# EAGLE design ScoutMakes_Azul (EAGLE 9.6.1)
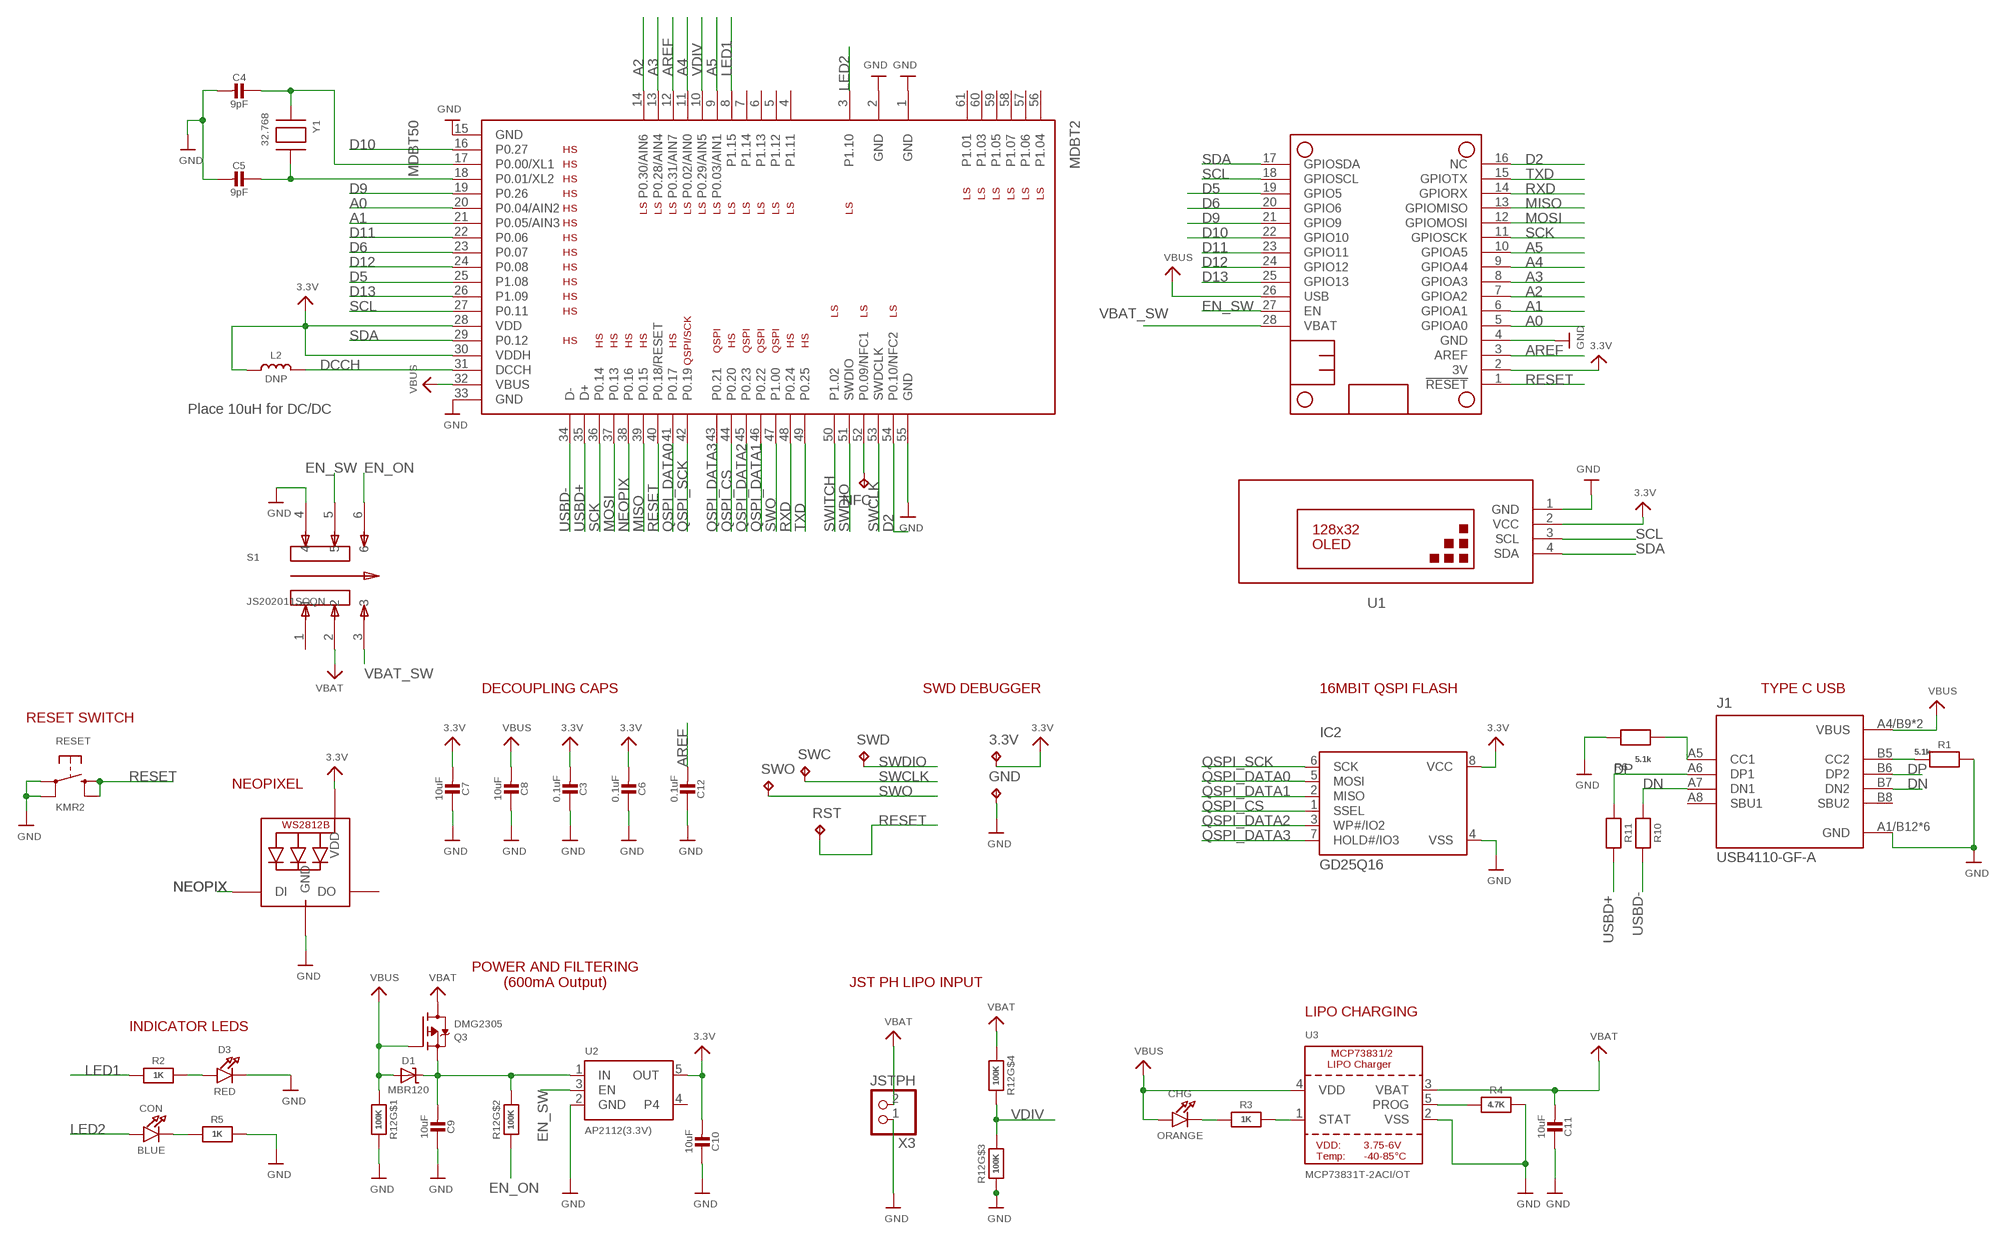
[diagram p0: schematic, sheet 1]

## Parts
3.3V  TPTP12R  [TP12R]
C3  0.1uF  CAP_CERAMIC0603_NO  [0603-NO]
C4  9pF  CAP_CERAMIC0603_NO  [0603-NO]
C5  9pF  CAP_CERAMIC0603_NO  [0603-NO]
C6  0.1uF  CAP_CERAMIC0603_NO  [0603-NO]
C7  10uF  CAP_CERAMIC0805-NOOUTLINE  [0805-NO]
C8  10uF  CAP_CERAMIC0805-NOOUTLINE  [0805-NO]
C9  10uF  CAP_CERAMIC0805-NOOUTLINE  [0805-NO]
C10  10uF  CAP_CERAMIC0805-NOOUTLINE  [0805-NO]
C11  10uF  CAP_CERAMIC0805-NOOUTLINE  [0805-NO]
C12  0.1uF  CAP_CERAMIC0603_NO  [0603-NO]
CHG  ORANGE  LED0805_NOOUTLINE  [CHIPLED_0805_NOOUTLINE]
CON  BLUE  LED0805_NOOUTLINE  [CHIPLED_0805_NOOUTLINE]
D1  MBR120  DIODE-SCHOTTKYSOD-123  [SOD-123]
D3  RED  LED0805_NOOUTLINE  [CHIPLED_0805_NOOUTLINE]
GND  TPTP12R  [TP12R]
IC2  GD25Q16  SPIFLASH_8PINUX  [USON8]
J1  USB4110-GF-A  [GCT_USB4110-GF-A]
L2  DNP  INDUCTOR_0805MP  [_0805MP]
LED  WS2812B3535  [LED3535]
MDBT2  MDBT50  [MDBT50]
MS1  FEATHERWING_NODIM  [FEATHERWING_NODIM]
NFC  TPTP10R  [TP10R]
Q3  DMG2305  MOSFET-P  [SOT23-R]
R1  5.1k  RESISTOR_0603_NOOUT  [0603-NO]
R2  1K  RESISTOR_0603_NOOUT  [0603-NO]
R3  1K  RESISTOR_0603_NOOUT  [0603-NO]
R4  4.7K  RESISTOR_0603_NOOUT  [0603-NO]
R5  1K  RESISTOR_0603_NOOUT  [0603-NO]
R6  5.1k  RESISTOR_0603_NOOUT  [0603-NO]
R10  22  RESISTOR_0603_NOOUT  [0603-NO]
R11  22  RESISTOR_0603_NOOUT  [0603-NO]
R12  100K  RESISTOR_4PACK  [RESPACK_4X0603]
RESET  KMR2  SWITCH_TACT_SMT4.6X2.8  [BTN_KMR2_4.6X2.8]
RST  TPTP12R  [TP12R]
S1  JS202011SCQN  [SW_JS202011SCQN]
SWC  TPTP12R  [TP12R]
SWD  TPTP12R  [TP12R]
SWO  TPTP12R  [TP12R]
U1  DISPLAY-OLED-128X32  [DISPLAY-OLED-128X32]
U2  AP2112(3.3V)  VREG_SOT23-5  [SOT23-5]
U3  MCP73831T-2ACI/OT  MCP73831/2  [SOT23-5]
X3  JSTPH  CON_JST_PH_2PIN  [JSTPH2]
Y1  32.768  XTAL-3.2X1.5  [XTAL3215]

## Nets
3.3V [power]: 3.3V.TP C3.2 C6.2 C7.2 C10.2 IC2.8(VCC) L2.1 LED.2(VDD) MDBT2.28(VDD) MDBT2.30(VDDH) MS1.2(3V) U1.2(VCC) U2.5(OUT)
A0: MDBT2.20(P0.04/AIN2) MS1.5(GPIOA0)
A1: MDBT2.21(P0.05/AIN3) MS1.6(GPIOA1)
A2: MDBT2.14(P0.30/AIN6) MS1.7(GPIOA2)
A3: MDBT2.13(P0.28/AIN4) MS1.8(GPIOA3)
A4: MDBT2.11(P0.02/AIN0) MS1.9(GPIOA4)
A5: MDBT2.9(P0.03/AIN1) MS1.10(GPIOA5)
AREF: C12.2 MDBT2.12(P0.31/AIN7) MS1.3(AREF)
D2: MDBT2.54(P0.10/NFC2) MS1.16(NC)
D5: MDBT2.25(P1.08) MS1.19(GPIO5)
D6: MDBT2.23(P0.07) MS1.20(GPIO6)
D9: MDBT2.19(P0.26) MS1.21(GPIO9)
D10: MDBT2.16(P0.27) MS1.22(GPIO10)
D11: MDBT2.22(P0.06) MS1.23(GPIO11)
D12: MDBT2.24(P0.08) MS1.24(GPIO12)
D13: MDBT2.26(P1.09) MS1.25(GPIO13)
DCCH: L2.2 MDBT2.31(DCCH)
DN: J1.A7(DN1) J1.B7(DN2) R10.1
DP: J1.A6(DP1) J1.B6(DP2) R11.1
EN_ON: R12.2 S1.6
EN_SW: MS1.27(EN) S1.5 U2.3(EN)
GND: C3.1 C4.2 C5.2 C6.1 C7.1 C8.1 C9.1 C10.1 C11.1 C12.1 D3.C GND.TP IC2.4(VSS) J1.A1/B12(GND) J1.B1/A12(GND) J1.S1(GND) J1.S2(GND) J1.S3(GND) J1.S4(GND) LED.4(GND) MDBT2.1(GND) MDBT2.2(GND) MDBT2.15(GND) MDBT2.33(GND) MDBT2.55(GND) MS1.4(GND) R1.2 R4.2 R5.2 R6.2 R12.3 R12.8 RESET.A'(P1) RESET.A(P) S1.4 U1.1(GND) U2.2(GND) U3.2(VSS) X3.1
LED1: MDBT2.8(P1.15) R2.1
LED2: CON.A MDBT2.3(P1.10)
MISO: MDBT2.39(P0.15) MS1.13(GPIOMISO)
MOSI: MDBT2.37(P0.13) MS1.12(GPIOMOSI)
N$1: C4.1 MDBT2.17(P0.00/XL1) Y1.P$1
N$2: C5.1 MDBT2.18(P0.01/XL2) Y1.P$2
N$3: CHG.C R3.1
N$4: J1.A5(CC1) R6.1
N$5: D3.A R2.2
N$6: J1.B5(CC2) R1.1
N$11: R3.2 U3.1(STAT)
N$12: R4.1 U3.5(PROG)
N$14: CON.C R5.1
NEOPIX: LED.1(DI) MDBT2.38(P0.16)
NFC1: MDBT2.52(P0.09/NFC1) NFC.TP
QSPI_CS: IC2.1(SSEL) MDBT2.44(P0.20)
QSPI_DATA0: IC2.5(MOSI) MDBT2.41(P0.17)
QSPI_DATA1: IC2.2(MISO) MDBT2.46(P0.22)
QSPI_DATA2: IC2.3(WP#/IO2) MDBT2.45(P0.23)
QSPI_DATA3: IC2.7(HOLD#/IO3) MDBT2.43(P0.21)
QSPI_SCK: IC2.6(SCK) MDBT2.42(P0.19)
RESET: MDBT2.40(P0.18/RESET) MS1.1(!RESET) RESET.B'(S1) RESET.B(S) RST.TP
RXD: MDBT2.48(P0.24) MS1.14(GPIORX)
SCK: MDBT2.36(P0.14) MS1.11(GPIOSCK)
SCL: MDBT2.27(P0.11) MS1.18(GPIOSCL) U1.3(SCL)
SDA: MDBT2.29(P0.12) MS1.17(GPIOSDA) U1.4(SDA)
SWCLK: MDBT2.53(SWDCLK) SWC.TP
SWDIO: MDBT2.51(SWDIO) SWD.TP
SWITCH: MDBT2.50(P1.02)
SWO: MDBT2.47(P1.00) SWO.TP
TXD: MDBT2.49(P0.25) MS1.15(GPIOTX)
USBD+: MDBT2.35(D+) R11.2
USBD-: MDBT2.34(D-) R10.2
VBAT [power]: C11.2 Q3.3(D) R12.4 S1.2 U3.3(VBAT) X3.2
VBAT_SW [power]: MS1.28(VBAT) S1.3
VBUS [power]: C8.2 CHG.A D1.A J1.A4/B9(VBUS) J1.B4/A9(VBUS) MDBT2.32(VBUS) MS1.26(USB) Q3.1(G) R12.1 U3.4(VDD)
VDIV: MDBT2.10(P0.29/AIN5) R12.5 R12.6
VHI [power]: C9.2 D1.C Q3.2(S) R12.7 U2.1(IN)
Unconnected: J1.A8(SBU1) J1.B8(SBU2) LED.3(DO) MDBT2.4(P1.11) MDBT2.5(P1.12) MDBT2.6(P1.13) MDBT2.7(P1.14) MDBT2.56(P1.04) MDBT2.57(P1.06) MDBT2.58(P1.07) MDBT2.59(P1.05) MDBT2.60(P1.03) MDBT2.61(P1.01) S1.1 U2.4

## Notes on the sheet
- Place 10uH for DC/DC
- DECOUPLING CAPS | SWD DEBUGGER | 16MBIT QSPI FLASH | TYPE C USB
- RESET SWITCH
- NEOPIXEL
- POWER AND FILTERING
  (600mA Output)
- JST PH LIPO INPUT
- LIPO CHARGING
- INDICATOR LEDS

## Library data of the parts
3.3V GND NFC RST SWC SWD SWO = testpad:TP: Test pad
C3-C12 = microbuilder:CAP_CERAMIC: Ceramic Capacitors For new designs, use the packages preceded by an '_' character since they are more reliable: The following footprints should be used on most boards: _0402 - Standard footprint for regular board layouts _0603 - Standard footprint for regular board layouts _0805 - Standard footprint for regular board layouts _1206 - Standard footprint for regular board layouts For extremely tight-pitch boards where space is at a premium, the following 'micro-pitch' footprints can be used (smaller pads, no silkscreen outline, etc.): _0402MP - Micro-pitch footprint for very dense/compact boards _0603MP - Micro-pitch footprint for very dense/compact boards _0805MP - Micro-pitch footprint for very dense/compact boards _1206MP - Micro-pitch footprint for very dense/compact boards
CHG CON D3 = microbuilder:LED: LED 0603 - 0603 Surface Mount Package 2mA: Green LED - Low Power (3.9mcd, 2ma, 1.7Vf) - Digikey: 475-2709-2-ND Orange LED - Low Power (9.8mcd, 2ma, 1.8Vf) - Digikey: 475-1194-2-ND Red LED - Low Power (5mcd, 2ma, 1.8Vf) - Digikey: 475-1195-2-ND Yellow LED - Low Power (7mcd, 2ma, 1.8Vf) - Digikey: 475-1196-2-ND 5mA: Blue LED - Low Power (17mcd, 5ma, 2.9Vf) - Digikey: LNJ937W8CRACT-ND 0805 - 0805 Surface Mount Package 2mA: Red LED (8.8mcd, 2mA, 1.8Vf, Clear) - Low Power [Digikey: 475-2510-1-ND] Green LED (5mcd, 2mA, 1.8Vf, Clear) - Low Power [Digikey: 475-2730-1-ND] Yellow LED (11.3mcd, 2mA, 1.8Vf, Clear) - Low Power [Digikey: 475-2555-1-ND] 20mA: Red LED (104mcd, 20mA, Diffused) - LS R976 [Digikey: 475-1278-6-ND] Red LED (12mcd, 20mA, 2.0Vf, Clear) - APT2012EC [Digikey: 754-1128-1-ND] Green LED (15mcd, 20mA, 2.2Vf, Clear) - APT2012GC [Digikey: 754-1131-1-ND] Orange LED (160mcd, 20mA, 2.1Vf, Clear) - APT2012SECK [Digikey: 754-1130-1-ND] 1206 - 1206 Surface Mount Package Green LED (26mcd, 20mA, Diffused) - LG N971 [Digikey: 475-1407-6-ND] Red LED (15mcd, 20mA, Diffused) - LH N974 [Digikey: 475-1416-6-ND] Cree - Cree High-Power Surface Mount LEDs XPEBWT-L1-0000-00D50 - White 111lm 350mA 2.9Vf 6200K 110° XTEAWT-00-0000-00000LEE3 - White 114lm 350mA 2.85Vf 5000K 115° Everlight - Everlight 45-21 Series Surface Mount LEDs 45-21/QK2C-B2832AC2CB2/2T - Warm White 2000mcd 20mA 3.25Vf 3050K 120° 45-21/LK2C-B38452C4CB2/2T - Nuetral White 2000mcd 20mA 3.25Vf 4150K 120° 45-21/LK2C-B50634C6CB2/2T - Cold White 2200mcd 20mA 3.25Vf 5650K 120° PLCC2 Reverse Mount LS T77K-J1L2-1-0-2-R18-Z - Red 11.25mcd 2mA 1.8Vf 630nm 120° LO T77K-L1M2-24-Z - Orange 19.6mcd 2mA 1.8Vf 606nm 120° LY T77K-K2M1-26-Z - Yellow 15.7mcd 2mA 1.8Vf 587nm 120°
D1 = microbuilder:DIODE-SCHOTTKY
IC2 = microbuilder:SPIFLASH_8PIN: SOIC8 SPI Flash Be careful with the size since SOIC8 flash comes in several 'widths' SOIC8 150 mil M25P16 - 16Mbit (2Mbit x 8) Serial Flash (75MHz SPI Bus), Supply: 2.7-3.6V Digikey: SOIC8 - M25P16-VMN6P-ND SOIC8 208 mil W25Q16BVSSIG - 16Mbit (2Mbit x 8) Serial Flash (104MHz SPI Bus), Supply: 2.7-3.6V Digikey: SOIC8 - W25Q16BVSSIG-ND
J1 = usb_typeC-USB4110-GF-A:USB4110-GF-A: CONN USB 2.0 TYPE-C R/A SMT; AVAILABILITY: Unavailable; DESCRIPTION: USB-C _USB TYPE-C_ USB 2.0 Receptacle Connector 24 _16+8 Dummy_ Position Surface Mount, Right Angle; Through Hole; MF: GCT; MP: USB4110-GF-A; PACKAGE: None; PRICE: None
L2 = microbuilder:INDUCTOR: Inductors 0603: 10nH Ceramic Inductor - microwire antenna/RF (Digikey: 712-1434-2-ND) 0805: 560nH Ceramic Inductor - RF (Digikey: 553-1047-1-ND) 270nH Ceramic Inductor - Q = 40@250MHz, +-5%, 1 Ohm DC Resistance (Digikey: 535-10506-2-ND) 1007 (2518 Metric) SMT: 10µH 10% 250mOhm 820mA 1007 Inductor (Digikey: 587-2189-1-ND) 22µH 10% 500mOhm 580mA 1007 Inductor (Digikey: 587-2190-1-ND) 47µH 10% 950mOhm 420mA 1007 Inductor (Digikey: 587-2191-1-ND) 47µH 5% 100mOhm 1A 1008 Inductor (Digikey: 732-1816-1-ND) 5.0x5.0mm (Taiyo Yuden NR5040 Series) 6.8µH 20% 2.3A 64mOhm Inductor (Digikey: 587-2374-2-ND) 5.0x5.0mm (TDK VLC5045 Series) 4.7µH 20% 3.3A 34mOhm Inductor (Digikey: 445-6526-1-ND) 6.8µH 20% 2.7A 46mOhm Inductor (Digikey: 445-6527-1-ND) 6.0x6.0mm (TDK VLC6045 Series) 4.7µH 20% 3.8A 27mOhm Inductor (Digikey: 445-6538-2-ND) 6.8µH 20% 3A 41mOhm Inductor (Digikey: 445-6540-1-ND) 6.2µH 30% 2.2A 45mOhm Inductor (Digikey: SRR5028-6R2YCT-ND) - Not TDK VLC6045 but footprint should match 6.0x6.0mm (TDK SLF6045 Series) 6.8uH 30% 2A 33mOhm Inductor (Digikey: 445-4572-1-ND, Mouser: 810-SLF645T6R8N2R0PF) 6.0x6.0mm (Sumida CDRH5D28 Series) 6.2uH 30% 1.8A 45mOhm Inductor (Digikey: 308-1542-1-ND) Taiyo Yuden NR3015T2R2M - 2.2uH 20% 1.5A (Digikey: 587-1648-2-ND, Mouser: 963-NR3015T2R2M) - Used with TI TPS62172 CoilCraft RFID Transponder Coil - MA5532-AE (For use with AS3935 Lightning Sensor) Taiyo Yuden NRH2412T2R2MNGH - 2.2uH 20% 1AA (Digikey: 587-3443-1-ND) - Used with TI LM3671 Vishay IHLP 1.0uH Molded Inductor - 24mOhm DCR, 5A, +/-20%, -55°C-125°C (Digikey: 541-1319-1-ND)
LED = microbuilder:WS2812B
MDBT2 = microbuilder:MDBT50: Raytac Corporation MDBT50 Bluetooth Low Energy Module based on Noridc nRF52840 Source: Raytac datasheet
MS1 = microbuilder:FEATHERWING
Q3 = microbuilder:MOSFET-P: P-Channel Mosfet LEGEND VDS: Voltage Drain-Source ID: Drain Current RDS(ON): Drain-Source On-State Resistance VGS(TH): Gate-Source Threshold Voltage CISS: Drain-Source Input Capacitance SOT-23 Name VDS ID RDS(ON) VGS(TH) CISS Order Number IRLML5103 30V 760mA 600 mOhm -- 75pF @ 25V Digikey: IRLML5103PBFCT-ND IRLML6401 12V 4.3A 50 mOhm 950mV @ 250µA 830pF @ 10V Digikey: IRLML6401PBFTR-ND NTR0202PL 20V 400mA 800 mOhm 2.3V @ 250uA 70pF @ 5V Digikey: NTR0202PLT1GOSTR-ND NTR4101PT1G 20V 1.8A 85 mOhm 1.2V @ 250uA 675pF @ 10V Digikey: NTR4101PT1GOSCT-ND DMP2004K 20V 600mA 900 mOhm 1V @ 250uA 175pF @ 16V Digikey: DMP2004KDICT-ND PMV65XP 20V 3.9A 76 mOhm 950mV @ 1mA 725pF @ 20V Digikey: 568-2358-2-ND TO-252 Name VDS ID RDS(ON) VGS(TH) CISS Order Number AOD417 30V 25A 34 mOhm 3V @ 250µA 920pF @ 15V Digikey: 785-1106-2-ND PowerPak Name VDS ID RDS(ON) VGS(TH) CISS Order Number AON7401 30V 12A 14 mOhm 3V @ 250µA 2600pF @ 15V Digikey: 785-1302-1-ND
R1-R6 R10 R11 = microbuilder:RESISTOR: Resistors For new designs, use the packages preceded by an '_' character since they are more reliable: The following footprints should be used on most boards: _0402 - Standard footprint for regular board layouts _0603 - Standard footprint for regular board layouts _0805 - Standard footprint for regular board layouts _1206 - Standard footprint for regular board layouts For extremely tight-pitch boards where space is at a premium, the following 'micro-pitch' footprints can be used (smaller pads, no silkscreen outline, etc.): _0402MP - Micro-pitch footprint for very dense/compact boards _0603MP - Micro-pitch footprint for very dense/compact boards _0805MP - Micro-pitch footprint for very dense/compact boards _1206MP - Micro-pitch footprint for very dense/compact boards
R12 = microbuilder:RESISTOR_4PACK: Resistor Packs (4 resistors) 4 x 0603 10K 1/16W - Digikey: YC164J-10KCT-ND
RESET = microbuilder:SWITCH_TACT_SMT: SMT Tact Switches 6x6mm - Digikey: P12940SCT-ND KMR2 (4.6x2.8mm) - Digikey: 401-1426-1-ND EVQ-PQHB55 - Light Touch, 160GF (4.5x4.5mm) - Digikey: P8090SCT-ND KMT0 - KMT021 NGJ LHS (etc.) IP68/Waterproof - Digikey: CKN10289CT-ND
S1 = slideswitch_DPDT_JS202011SCQN:JS202011SCQN: JS Series DPDT On-On Gull Wing Surface Mount Subminiature Slide Switch; DESCRIPTION: Slide Switch DPDT Surface Mount; DIGI-KEY_PART_NUMBER: 401-2002-1-ND; DIGI-KEY_PURCHASE_URL: https://www.digikey.com/product-detail/en/c-k/JS202011SCQN/401-2002-1-ND/1640098?utm_source=snapeda&utm_medium=aggregator&utm_campaign=symbol; MF: C&K; MP: JS202011SCQN; PACKAGE: None
U1 = diy-modules:DISPLAY-OLED-128X32: 128x32 Dot Matrix OLED Module with I2C interface based on SSD1306 chip More details available here: http://www.tinyosshop.com/index.php?route=product/product&product_id=953 Schematic available here: http://www.tinyosshop.com/datasheet/OLED%2012832.pdf SSD1306 datasheet: https://cdn-shop.adafruit.com/datasheets/SSD1306.pdf Click here to find device on ebay.com <http://www.ebay.com/sch/oled+display+128x32+i2c>
U2 = microbuilder:VREG_SOT23-5: SOT23-5 Fixed Voltage Regulators Part Current Out V Out V In V Dropout θJA (°C/W) TJ (°C) Digikey Part No. ADP121 150mA 3.3V 3.4-5.5V 0.09V @ 150mA -- -- ADP121-AUJZ33R7CT-ND ADP121 150mA 3.0V 3.1-5.5V 0.09V @ 150mA -- -- ADP121-AUJZ30R7CT-ND ADP122 300mA 3.3V 3.4-5.5V 0.085V @ 300mA -- -- ADP122AUJZ-3.3-R7CT-ND ADP1712 300mA 3.3V 3.5-5.5V 0.17V @ 300mA -- -- ADP1712AUJZ-3.3-R7TR-ND AP7311 (Low Cost) 150mA 3.3V 3.5-6V 0.15V @ 150mA -- -- AP7311-33WG-7DICT-ND LD39015M18R 150mA 1.8V 1.9V-5.5V 0.08V @ 100mA -- -- 497-6977-1-ND LP2985A-33DBVR 150mA 3.3V 3.3-16V 0.28V @ 150mA 206 150 296-18479-1-ND MCP1824T-3302E/OT 300mA 3.3V 3.5V-6V 0.2V @ 300mA -- -- MCP1824T-3302E/OTCT-ND MIC5205-2.5YM5 TR 150mA 2.5V 2.7-16V 0.165V @ 150mA -- -- 576-1257-2-ND MIC5205-3.0YM5 TR 150mA 3.0V 3.2V-16V 0.165V @ 150mA -- -- 576-1258-2-ND MIC5205-3.3YM5 TR 150mA 3.3V 3.5V-16V 0.165V @ 150mA -- -- 576-1259-2-ND TPS780330220 150mA 3.3V+2.2V 3.6-5.5V 250mV Max -- -- 296-23332-1-ND TDA3663/N1,135 100mA 3.3V 3.5-45V 0.18V @ 50mA -- -- 568-5343-1-ND Max operating temp can be calculated using θJA, TJ (max junction temperature), and power in watts. Set the "Maximum Ambient Temperature" until it reaches TJ ("Max Junction Temperature"), which is the absolute limit for safe use of the regulator: Heat Sink Temperature Calculator <http://www.daycounter.com/Calculators/Heat-Sink-Temperature-Calculator.phtml> For example, With 12V source into a 3.3V LP2985 and a 30mA load, we are dissipating (12V-3.3V) * 0.03A = 0.261W. With a θJA of 206 °C/W, a TJ of 150°C, and 261mW we can safely use the chip without a heat sink up to 75°C (=147.1°C Junction Temperature).
U3 = microbuilder:MCP73831/2: MCP73831/2 LIPO Charger VDD: 3.75 - 6V Temp -40 - 85°C Programmable Charge Rate: 15-500mA NOTE: STAT is a tri-state logic output on the MCP73831 and an open-drain output on the MCP73832. SOT23-5 with 4.2V output and tri-state logic on STAT = MCP73831T-2ACI/OT
X3 = microbuilder:CON_JST_PH_2PIN: JST 2-Pin Right-Angle Connector PH-Series - 4UConnector: 17311 SH-Series - 4UConnector: 07278
Y1 = adafruit2:XTAL: Low cost SMT crystals, no capacitors included http://www.ladyada.net/library/eagle

## Net classes
1 power: width 0.254 mm

## Board
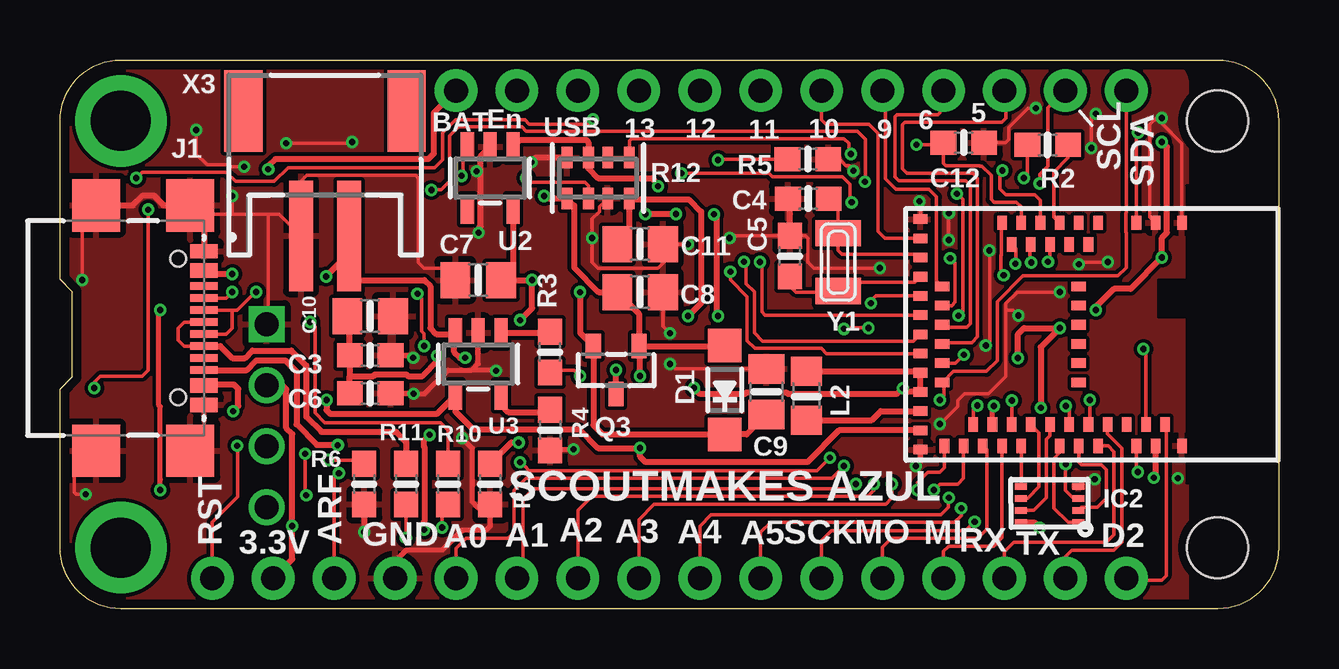
[diagram p1: board, top side]
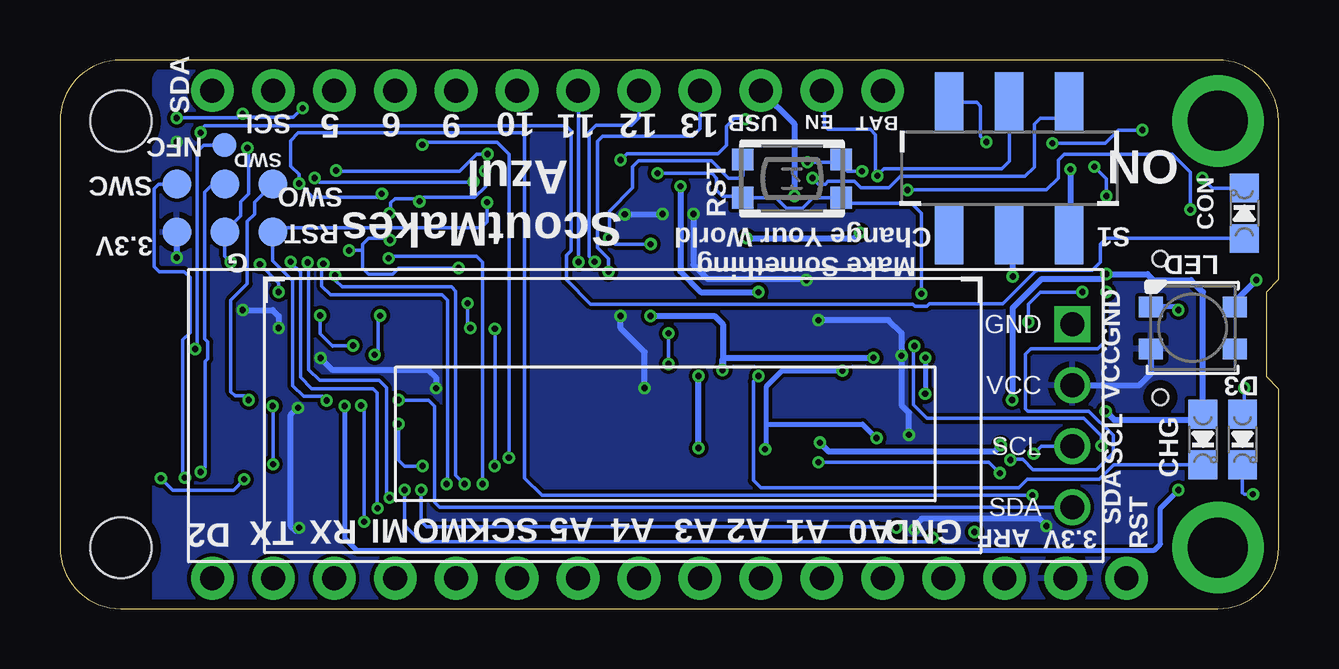
[diagram p2: board, bottom side, seen from below]

Size 50.8 x 22.86 mm. Coordinates in mm from the lower left corner, seen from the top.
Outline: 2.54,22.86 48.26,22.86 arc-90 50.8,20.32 50.8,2.54 arc-90 48.26,0 2.54,0 arc-90 0,2.54 0,9.14 0.51,9.65 0.51,13.21 0,13.72 0,20.32 arc-90 2.54,22.86
Copper layers (1*16): Top 0.035559375mm / dielectric 1.6mm / Bottom 0.035559375mm
Design rules "oshpark-2layer_Nov2019 *": minimum track width 6mil, minimum drill 10mil, track to track 6mil, track to pad 6mil, pad to pad 6mil, via to via 6mil, smd to smd 6mil, copper to edge 15mil, drill to drill 6mil, minimum pad ring 5mil, minimum via ring 5mil, stop-mask expansion 2.5mil, vias tented up to drill 20mil, thermal gap 10mil

### Footprints (pad centres in the part's own frame; a part is rotated, then mirrored left to right if it is on the bottom)
TP12R = smd 1.2 x 1.2: TP 0,0
0603-NO = smd 1.075 x 1: 1 -0.85,0; 2 0.85,0
0805-NO = smd 1.24 x 1.5: 1 -0.95,0; 2 0.95,0
CHIPLED_0805_NOOUTLINE = smd 1.2 x 1.2: A 0,-1.05; C 0,1.05
SOD-123 = smd 1.4 x 1.4: A 1.85,0; C -1.85,0
USON8 = smd 0.5 x 0.275: 1 -1.2,0.75; 2 -1.2,0.25; 3 -1.2,-0.25; 4 -1.2,-0.75; 5 1.2,-0.75; 6 1.2,-0.25; 7 1.2,0.25; 8 1.2,0.75
GCT_USB4110-GF-A = smd 0.6 x 1.15: A1/B12 -3.2,1.075; A4/B9 -2.4,1.075; B1/A12 3.2,1.075; B4/A9 2.4,1.075 | smd 0.3 x 1.15: A5 -1.25,1.075; A6 -0.25,1.075; A7 0.25,1.075; A8 1.25,1.075; B5 1.75,1.075; B6 0.75,1.075; B7 -0.75,1.075; B8 -1.75,1.075 | smd 2.18 x 2: S1 -5.11,0.5; S2 5.11,0.5; S3 -5.11,-3.43; S4 5.11,-3.43 | hole 0.65: -2.89,0; 2.89,0
_0805MP = smd 1.2 x 1.3: 1 -1.016,0; 2 1.016,0
LED3535 = smd 1 x 0.85: 1 -1.75,0.875; 2 -1.75,-0.875; 3 1.75,-0.875; 4 1.75,0.875
MDBT50 = smd 0.6 x 0.4: 1 -4.65,3.75; 2 -4.65,2.65; 3 -4.65,1.85; 4 -4.65,0.25; 5 -3.75,-0.15; 6 -4.65,-0.55; 7 -3.75,-0.95; 8 -4.65,-1.35; 9 -3.75,-1.75; 10 -4.65,-2.15; 11 -3.75,-2.55; 12 -4.65,-2.95; 13 -3.75,-3.35; 14 -4.65,-3.75; 34 4.65,-6.15; 35 4.65,-5.35; 36 3.75,-4.95; 37 4.65,-4.55; 38 3.75,-4.15; 39 4.65,-3.75; 40 3.75,-3.35; 41 4.65,-2.95; 42 3.75,-2.55; 43 3.75,-1.75; 44 4.65,-1.35; 45 3.75,-0.95; 46 4.65,-0.55; 47 3.75,-0.15; 48 4.65,0.25; 49 3.75,0.65; 50 3.75,1.45; 51 4.65,1.85; 52 3.75,2.25; 53 4.65,2.65; 54 3.75,3.05; 55 4.65,3.75 | smd 0.4 x 0.6: 15 -4.8,-7.15; 16 -4,-7.15; 17 -3.2,-7.15; 18 -2.4,-7.15; 19 -2,-6.25; 20 -1.6,-7.15; 21 -1.2,-6.25; 22 -0.8,-7.15; 23 -0.4,-6.25; 24 0,-7.15; 25 0.4,-6.25; 26 0.8,-7.15; 27 1.2,-6.25; 28 1.6,-7.15; 29 2,-6.25; 30 2.4,-7.15; 31 3.2,-7.15; 32 4,-7.15; 33 4.8,-7.15; 56 -2,-0.55; 57 -1.2,-0.55; 58 -0.4,-0.55; 59 0.4,-0.55; 60 1.2,-0.55; 61 2,-0.55
FEATHERWING_NODIM = drill 1 pad 1.778: 1 6.35,1.27; 2 8.89,1.27; 3 11.43,1.27; 4 13.97,1.27; 5 16.51,1.27; 6 19.05,1.27; 7 21.59,1.27; 8 24.13,1.27; 9 26.67,1.27; 10 29.21,1.27; 11 31.75,1.27; 12 34.29,1.27; 13 36.83,1.27; 14 39.37,1.27; 15 41.91,1.27; 16 44.45,1.27; 17 44.45,21.59; 18 41.91,21.59; 19 39.37,21.59; 20 36.83,21.59; 21 34.29,21.59; 22 31.75,21.59; 23 29.21,21.59; 24 26.67,21.59; 25 24.13,21.59; 26 21.59,21.59; 27 19.05,21.59; 28 16.51,21.59 | drill 2.5 pad 3.81: P$1 2.54,20.32; P$2 2.54,2.54 | hole 2.54: 48.26,20.32; 48.26,2.54
TP10R = smd 1 x 1: TP 0,0
SOT23-R = smd 0.635 x 1.016: 1 -0.95,-1; 2 0.95,-1; 3 0,1
RESPACK_4X0603 = smd 0.45 x 0.9: 1 -1.3,-0.85; 2 -0.4,-0.85; 3 0.4,-0.85; 4 1.3,-0.85; 5 1.3,0.85; 6 0.4,0.85; 7 -0.4,0.85; 8 -1.3,0.85
BTN_KMR2_4.6X2.8 = smd 0.9 x 0.9: A 2.05,0.8; A' -2.05,0.8; B 2.05,-0.8; B' -2.05,-0.8
SW_JS202011SCQN = smd 1.2 x 2.5: 1 -2.5,-2.75; 2 0,-2.75; 3 2.5,-2.75; 4 -2.5,2.75; 5 0,2.75; 6 2.5,2.75
DISPLAY-OLED-128X32 = drill 1 square: 1 -17.78,-3.81 | drill 1: 2 -17.78,-1.27; 3 -17.78,1.27; 4 -17.78,3.81
SOT23-5 = smd 0.55 x 1.2: 1 -0.95,-1.3; 2 0,-1.3; 3 0.95,-1.3; 4 0.95,1.3; 5 -0.95,1.3
JSTPH2 = smd 1 x 4.6: 1 -1,-3.7; 2 1,-3.7 | smd 1.6 x 3.4: NC1 -3.4,1.5; NC2 3.4,1.5
XTAL3215 = smd 1.1 x 1.9: P$1 1.2,0; P$2 -1.2,0

### Placement (x,y rotation side)
3.3V  45.93,15.69 0 bottom
C3  12.93,10.56 180 top
C4  31.19,17.09 180 top
C5  30.43,14.69 90 top
C6  12.93,8.98 180 top
C7  17.43,13.69 0 top
C8  24.18,13.19 180 top
C9  29.44,9.04 270 top
C10  12.93,12.19 180 top
C11  24.18,15.19 180 top
C12  37.67,19.42 180 top
CHG  3.16,7.05 180 bottom
CON  1.43,16.47 0 bottom
D1  27.71,9.11 90 top
D3  1.51,7.05 180 bottom
GND  43.93,15.69 0 bottom
IC2  41.25,4.35 180 top
J1  4.93,11.69 270 top
L2  31.11,8.87 270 top
LED  3.59,11.7 0 bottom
MDBT2  43.01,11.43 270 top
MS1  0,0 0 top
NFC  43.94,19.32 0 bottom
Q3  23.18,9.94 180 top
R1  17.93,5.19 270 top
R2  41.17,19.32 180 top
R3  20.43,10.69 90 top
R4  20.43,7.44 270 top
R5  31.17,18.73 0 top
R6  12.68,5.19 270 top
R10  16.18,5.19 270 top
R11  14.43,5.19 270 top
R12  22.43,17.94 0 top
RESET  20.29,17.92 0 bottom
RST  41.93,15.69 0 bottom
S1  11.24,18.34 0 bottom
SWC  45.93,17.69 0 bottom
SWD  43.93,17.69 0 bottom
SWO  41.93,17.69 0 bottom
U1  26.39,8.04 180 bottom
U2  17.93,17.94 180 top
U3  17.43,10.19 180 top
X3  11.05,19.23 0 top
Y1  32.43,14.44 90 top

### Tracks (layer width: path | path; a pad name or v marks a point on that pad's centre or on a via)
3.3V  (via drill 0.25)
  Top 0.254: L2.1 35.81,9.89 MDBT2.28 MDBT2.30 35.27,9.03 v35.13,9.17 v35.13,9.18 v35.12,9.18 34.88,8.94 30.35,8.94 30.31,8.99 28.58,8.99 28.53,8.94 26.68,8.94 v26.43,9.19 | U2.5 18.88,14.19 C7.2 v19.68,13.69 19.68,12.52 v19.18,12.02 | C6.2 12.08,9.69 | 12.08,9.69 C3.2 12.08,12.09 C10.2 | v45.93,19.44 46.14,19.23 46.14,15.66 45.93,15.45 v45.93,14.63 44.63,13.32 43.93,13.32 43.18,12.57 v43.18,12.44 | v40.88,8.37 40.88,10.89 v41.68,11.69 40.18,11.69 39.93,11.44 v39.93,10.44 | v25.68,16.44 v24.4,16.44 | v27.26,16.42 27.37,16.3 27.37,12.25 v27.43,12.19 | MS1.2 9.68,2.06 v9.68,3.44 9.68,7.28 9.44,7.52 9.44,9.14 9.26,9.31 U1.2 | v15.41,7.24 15.18,7.01 15.18,6.72 15.21,6.69 15.21,3.69 15.18,3.66 v15.18,3.29 | v15.72,10.54 15.72,10.3 15.11,9.69 14.5,9.69 14.44,9.76 13.13,9.76 13.06,9.69 12.08,9.69 | IC2.8 40.61,3.6 v40.83,3.37
  Bottom 0.254: 3.3V.TP v45.93,14.63 | v40.83,3.37 40.97,3.24 41.18,3.44 41.18,8.07 v40.88,8.37 | v35.13,9.18 35.13,9.64 35.43,9.94 39.43,9.94 v39.93,10.44 | v43.18,12.44 41.93,12.44 41.68,12.19 v41.68,11.69 | v26.43,9.19 26.43,10.69 27.43,11.69 v27.43,12.19 | v27.26,16.42 25.7,16.42 v25.68,16.44 | v24.4,16.44 24.4,14.33 23.81,13.74 19.73,13.74 v19.68,13.69 | LED.2 5.34,9.78 5.81,9.31 U1.2 | v9.68,3.44 9.99,3.75 14.87,3.75 15.18,3.44 v15.18,3.29 | v15.41,7.24 15.41,8.17 15.72,8.48 v15.72,10.54 v15.73,10.53 15.73,11.49 16.26,12.02 v19.18,12.02
  pour Bottom: 0.01,20.56 arc-90 2.04,22.6 46.24,22.6 arc-90 46.9,21.93 46.9,-0.01 2.8,-0.01 arc-90 0.01,2.78
A0  (via drill 0.25)
  Top 0.152: MS1.5 16.51,2.52 16.93,2.94 18.68,2.94 18.93,3.19 18.93,4.94 19.43,5.44 32.18,5.44 v32.68,5.94 | v32.67,11.65 32.72,11.7 v33.69,11.7 v33.7,11.69 | MDBT2.20 34.02,13.03 33.81,12.82 v33.81,12.73
  Bottom 0.152: v32.68,5.94 v32.67,5.95 v32.67,11.65 | v33.81,12.73 33.81,11.8 v33.7,11.69
A1  (via drill 0.25)
  Top 0.152: MS1.6 19.3,1.52 19.3,4.56 19.74,5 32.99,5 v33.18,5.19 | MDBT2.21 37.17,12.63 37.31,12.77 37.31,14.41 37.11,14.6 v37.1,14.6
  Bottom 0.152: v37.1,14.6 37.12,14.62 37.06,14.69 33.44,14.69 33.18,14.43 v33.18,5.19
A2  (via drill 0.25)
  Top 0.152: MS1.7 21.59,4.1 22.18,4.69 33.68,4.69 33.93,4.94 v33.93,5.19 | v39.33,13.9 39.33,13.91 39.23,14.01 39.23,14.72 39.23,15.86 39.26,15.89 MDBT2.14
  Bottom 0.152: v33.93,5.19 34.3,5.56 34.3,13.22 34.49,13.4 39.04,13.4 39.33,13.69 v39.33,13.9
A3  (via drill 0.25)
  Top 0.152: MS1.8 24.13,3.71 24.77,4.36 34.42,4.36 34.68,4.61 v34.68,5.19 | v39.82,14.37 39.85,14.41 39.85,14.99 MDBT2.13
  Bottom 0.152: v34.68,5.19 34.64,5.23 34.64,12.84 34.88,13.08 39.52,13.08 39.89,13.44 39.89,14.31 v39.82,14.37
A4  (via drill 0.25)
  Top 0.152: MS1.9 26.67,3.43 27.14,3.91 36.72,3.91 37.04,4.22 37.04,4.6 v37.06,4.62 | v40.48,14.42 40.48,14.47 40.49,14.48 40.43,14.54 40.43,15.15 MDBT2.11
  Bottom 0.152: v37.06,4.62 37.19,4.75 37.19,9.2 37.5,9.51 39.98,9.51 40.44,9.96 40.44,14.38 v40.48,14.42
A5  (via drill 0.25)
  Top 0.152: MS1.10 29.21,3.17 29.63,3.6 37.29,3.6 37.57,3.88 v37.57,4.18 | v41.18,14.45 41.18,14.48 41.26,14.56 MDBT2.9
  Bottom 0.152: v37.57,4.18 v37.57,4.19 37.57,8.99 37.75,9.17 40.31,9.17 40.77,9.63 40.77,14.01 41.2,14.44 v41.18,14.45
AREF  (via drill 0.25)
  Top 0.152: MS1.3 11.43,5.45 v11.63,5.65 | v19.18,6.1 19.36,5.92 19.38,5.92 19.56,5.75 31.56,5.75 v32.09,6.28 | v35.7,19.32 36.72,19.32 C12.2 36.82,18.55 36.93,18.45 38.34,18.45 38.34,18.44 38.43,18.44 38.82,18.05 38.82,17.05 38.93,16.94 39.87,16.94 40.06,16.74 MDBT2.12
  Bottom 0.152: v11.63,5.65 12.07,6.1 v19.18,6.1 | v32.09,6.28 32.09,18.94 32.58,19.43 35.59,19.43 v35.7,19.32
D2
  Top 0.152: MDBT2.54 46.1,7.64 46.1,1.37 45.93,1.19 44.52,1.19 MS1.16
D5
  Top 0.152: MDBT2.25 36.82,11.09 38.01,11.09 38.25,11.33 38.25,17.94 38.05,18.14 35.3,18.14 35.11,18.34 35.11,20.17 35.21,20.27 39.26,20.27 39.43,20.44 39.43,21.53 MS1.19
D6
  Top 0.152: MDBT2.23 36.87,11.72 37.8,11.72 37.94,11.86 37.94,17.65 37.77,17.83 34.97,17.83 34.8,17.99 34.8,20.49 34.9,20.59 36.59,20.59 36.83,20.82 MS1.20
D9
  Top 0.152: MDBT2.19 36.54,13.65 36.54,17.15 36.21,17.48 34.84,17.48 34.4,17.92 34.4,21.48 MS1.21
D10
  Top 0.152: MS1.22 31.75,20.37 31.93,20.19 33.72,20.19 34.09,19.82 34.09,15.72 34.38,15.44 MDBT2.16
D11  (via drill 0.25)
  Top 0.152: v29.18,14.44 29.25,14.37 29.25,12.37 29.39,12.23 MDBT2.22
  Bottom 0.152: v29.18,14.44 29.18,21.56 MS1.23
D12  (via drill 0.25)
  Top 0.152: MDBT2.24 35.58,11.15 29.29,11.15 28.95,11.49 28.95,13.2 28.6,13.54 28.6,14.36 v28.51,14.45
  Bottom 0.152: v28.51,14.45 28.74,14.67 28.74,19.85 28.45,20.14 26.99,20.14 26.67,20.45 MS1.24
D13  (via drill 0.25)
  Top 0.152: MDBT2.26 31.94,10.63 31.73,10.84 28.96,10.84 28.64,11.16 28.64,12.99 27.94,13.69 v27.94,14.04
  Bottom 0.152: MS1.25 24.13,19.99 24.43,19.69 28.18,19.69 28.4,19.47 28.4,15.04 27.94,14.58 v27.94,14.04
DCCH
  Top 0.254: L2.2 33.84,7.85 34.22,8.23 MDBT2.31
DN  (via drill 0.25)
  Top 0.152: R10.1 16.18,7.44 15.87,7.75 11.04,7.75 10.63,8.16 10.63,11.74 v10.43,11.94 | 7.18,12.44 7.38,12.44 8.13,13.19 v8.18,13.19 | 7.18,12.44 J1.B7 | J1.A7 6.93,11.44 7.18,11.69 7.18,12.44
  Bottom 0.152: v8.18,13.19 9.93,13.19 10.43,12.69 v10.43,11.94
DP
  Top 0.152: J1.A6 5.18,11.94 4.93,11.69 4.93,11.19 5.18,10.94 J1.B6
  Top 0.254: J1.B6 6.68,10.94 7.18,10.44 7.71,10.44 8.02,10.75 9.64,10.75 10.27,10.13 10.27,7.99 10.9,7.36 14.01,7.36 14.43,6.94 R11.1
EN_ON  (via drill 0.25)
  Top 0.152: v19.43,17.94 19.6,17.77 21.89,17.77 22.03,17.63 R12.2
  Bottom 0.152: S1.6 8.74,20.44 9.93,20.44 10.18,20.19 10.18,18.4 10.57,18.01 15.76,18.01 16.24,17.53 17.42,17.53 17.69,17.8 18.78,17.8 18.89,17.69 19.18,17.69 v19.43,17.94
EN_SW  (via drill 0.25)
  Top 0.152: v16.73,18.03 16.81,18.11 16.81,19.07 U2.3
  Bottom 0.152: S1.5 11.24,18.64 11.55,18.33 16.45,18.33 v16.73,18.04 v16.73,18.03 16.8,18.1 16.8,19.74 17.03,19.97 18.8,19.97 18.93,20.1 18.93,21.47 MS1.27
GND  (via drill 0.25)
  Top 0.152: IC2.4 42.76,5.41 43.1,5.41 v43.13,5.39 | J1.B1/A12 6.01,7.16 J1.S2 | J1.S3 0.93,16.23 v0.93,13.69 | 5.74,16.5 5.79,16.44 7.18,16.44 | 7.18,16.44 8.68,16.44 | 8.68,16.44 9.14,16.44 X3.1 10.05,17.81 10.29,18.05 11.45,18.05 11.45,18.06 14.82,18.06 14.93,17.94 14.93,14.44 15.18,14.19 15.98,14.19 C7.1 | MDBT2.1 46.76,19.37 45.94,20.19 v45.94,20.43 v45.93,20.44 45.69,20.44 45.44,20.19 45.44,16.3 MDBT2.2 | C9.1 25.64,9.99 v25.43,10.19 | v25.43,11.47 25.13,11.77 C8.1 | R5.2 32.49,18.73 32.77,18.46 32.91,18.46 33.18,18.19 33.12,18.19 v33.08,18.24 | v35.82,16.97 35.86,16.92 MDBT2.15 | v27.91,15.44 28.01,15.54 C5.2 31.08,15.54 31.18,15.44 31.18,14.44 31.43,14.19 v34.18,14.19 | v26.18,15.19 25.18,15.19 | C11.1 25.18,15.19 | v37.06,16.47 37.04,16.47 37.02,16.45 37.02,15.39 v37.05,15.36 | C12.1 39.41,19.42 39.55,19.56 39.55,20.06 40.35,20.86 v40.68,20.86 | v42.99,19.19 42.99,20.66 43.08,20.76 43.18,20.66 v43.18,20.62 | v36.68,7.69 37.43,8.44 37.43,8.69 37.69,8.95 38.69,8.95 39.43,9.69 39.43,12.44 | 39.43,12.44 39.43,12.71 39.91,13.19 v41.68,13.19 | v42.47,14.35 42.47,14.38 42.53,14.44 v43.68,14.44 | v38.74,14.92 38.76,14.9 38.76,11.14 v38.59,10.96 | v39.95,12.21 39.72,12.44 39.43,12.44 | v17.37,18.22 17.53,18.05 17.53,15.93 | R12.3 22.48,16.75 22.48,16.55 22.18,16.24 v22.18,15.44 22.18,14.44 22.43,14.19 24.93,14.19 25.18,14.44 25.18,15.19 | v1.07,4.76 0.68,4.76 0.59,4.85 0.59,6.69 1.39,6.69 J1.S4 | 8.68,16.44 8.68,11.92 U1.1 | 7.18,16.44 v7.18,17.19 | v7.68,18.41 7.14,18.41 7.06,18.5 6.13,18.5 5.68,18.94 v5.68,19.94 | v9.43,19.39 12.13,19.39 v12.18,19.44
  Top 0.2: MDBT2.33 35.86,6.12 v35.68,5.94 | R1.2 17.93,4.19 | 17.93,4.19 17.93,3.44 17.76,3.27 16.76,3.27 15.93,2.44 14.43,2.44 13.97,1.98 MS1.4 | C3.1 14.62,10.56 v14.73,10.45 | C6.1 14.71,8.98 v14.74,8.95 15.18,8.95 16.18,9.94 16.72,9.94 17.18,9.94 | U3.2 17.43,10.65 17.43,10.2 17.18,9.94 | R4.2 20.48,6.64 v21.41,6.64 | v18.18,9.91 18.15,9.94 17.18,9.94 | v16.76,7.11 17.18,6.69 17.18,6.68 17.18,4.44 17.43,4.19 17.93,4.19
  Top 0.254: J1.A1/B12 6.01,16.23 5.74,16.5 J1.S1 4.32,16.8 3.9,17.22 3.46,17.22 3.04,16.8 J1.S3 | C5.2 30.43,16.99 C4.2 | R6.2 v12.68,3.19 | R12.8 19.84,18.79 v19.65,18.6 | v17.45,15.67 17.45,15.84 17.53,15.93 17.53,18.85 U2.2
  Bottom 0.152: v43.13,5.39 43.57,4.94 46.1,4.94 v46.59,5.43 | v25.43,10.19 v25.43,11.47 | v33.08,18.24 33.08,17.99 33.07,17.98 33.07,17.58 33.51,17.14 35.64,17.14 35.76,17.02 | 35.76,17.02 v35.82,16.97 | v26.18,15.19 27.66,15.19 v27.91,15.44 27.9,15.45 27.9,16.57 26.93,17.54 26.93,18.41 26.68,18.66 23.65,18.66 22.93,17.94 22.43,17.94 22.34,18.03 RESET.A' | v34.18,14.19 36.68,14.19 36.93,13.94 37.93,13.94 38.18,14.19 38.18,14.92 | v37.05,15.36 37.13,15.44 37.93,15.44 38.18,15.19 38.18,14.92 | v37.06,16.47 37.01,16.52 37.01,16.9 36.84,17.07 35.82,17.07 35.76,17.02 | v40.68,20.86 41.07,20.47 43.38,20.47 | v45.93,20.44 v45.92,20.45 43.4,20.45 43.38,20.47 | v42.99,19.19 42.93,19.14 42.93,18.19 42.94,18.19 42.94,17.29 43.26,16.96 43.26,16.36 GND.TP 43.93,14.69 v43.68,14.44 | v43.18,20.62 43.23,20.62 43.38,20.47 | v35.68,5.94 36.43,5.94 36.68,6.19 v36.68,7.69 | v41.68,13.19 41.68,13.38 41.68,13.57 v42.47,14.35 | 38.18,14.92 v38.74,14.92 | v38.59,10.96 39.41,10.96 39.43,10.94 39.95,11.46 v39.95,12.21 | v17.37,18.22 v17.37,18.23 17.98,18.23 18.24,18.48 RESET.A | D3.C 1.51,4.83 1.44,4.76 v1.07,4.76 | v7.18,17.19 7.18,17.91 v7.68,18.41 | v5.68,19.94 6.68,19.94 7.23,19.39 v9.43,19.39 | v12.18,19.44 12.43,19.69 12.43,20.94 12.58,21.09 S1.4 | 18.36,18.6 v19.65,18.6
  Bottom 0.2: v14.73,10.45 v14.73,10.44 v14.73,8.95 v14.74,8.95 | v21.41,6.64 21.35,6.7 21.35,7.69 | v18.18,9.91 20.71,9.91 21.35,9.27 21.35,7.69 | v16.76,7.11 17.34,7.69 21.35,7.69
  Bottom 0.254: LED.4 1.84,12.78 v0.93,13.69 | 18.36,18.6 RESET.A | v22.18,15.44 17.68,15.44 v17.45,15.67
  pour Top: 0.01,20.56 arc-90 2.3,22.85 45.98,22.85 arc-90 46.99,21.84 46.99,-0.01 2.8,-0.01 arc-90 0.01,2.78
LED1
  Top 0.152: MDBT2.8 41.43,16.31 41.43,18.19 42.02,18.78 R2.1
LED2  (via drill 0.25)
  Top 0.152: MDBT2.3 44.86,19.76 v44.94,19.84
  Bottom 0.152: v44.94,19.84 44.94,19.95 44.76,20.12 29.71,20.12 29.49,19.91 29.49,14.91 29.69,14.71 29.69,13.7 28.68,12.69 15.25,12.69 15.17,12.61 14.67,12.61 14.56,12.71 11.5,12.71 10.12,14.09 10.08,14.09 10.1,14.11 7.77,14.11 7.43,14.44 7.43,15.19 7.18,15.44 1.45,15.44 CON.A
MISO
  Top 0.152: MDBT2.39 39.26,2.95 38.92,2.61 37.05,2.61 36.83,2.39 MS1.13
MOSI
  Top 0.152: MDBT2.37 38.63,6.61 38.63,3.31 38.26,2.93 34.66,2.93 34.29,2.56 MS1.12
N$1
  Top 0.152: MDBT2.17 35.72,14.77 32.6,14.77 32.43,14.94 Y1.P$1 32.43,16.69 C4.1
N$2
  Top 0.152: C5.1 30.43,13.44 30.68,13.19 32.38,13.19 Y1.P$2 32.78,13.59 35.63,13.59 MDBT2.18
N$3  (via drill 0.25)
  Top 0.152: v21.68,9.69 21.43,9.94 20.53,9.94 R3.1
  Bottom 0.152: CHG.C 6.87,6 7.49,5.39 10.49,5.39 10.84,5.03 21.59,5.03 21.9,5.34 21.9,9.47 v21.68,9.69
N$4  (via drill 0.25)
  Top 0.152: J1.A5 6.93,12.94 v7.18,13.19 | v11.18,6.19 12.53,6.19 R6.1
  Bottom 0.152: v7.18,13.19 7.31,13.07 7.31,11.07 7.54,10.83 10.32,10.83 10.55,10.6 10.55,8.33 10.46,8.23 7.91,8.23 6.9,7.22 6.9,6.49 7.59,5.79 10.24,5.79 10.67,6.22 11.15,6.22 v11.18,6.19
N$5  (via drill 0.25)
  Top 0.152: R2.2 40.32,18.08 v40.18,17.94 | v33.56,17.78 v33.57,17.79 33.57,19.56 33.24,19.89 19.43,19.89 19.25,20.07 16.61,20.07 16.24,19.7 16.24,17.8 15.88,17.44 v15.48,17.44 | v3.68,16.63 3.68,9.94 3.43,9.69 1.68,9.69 1.43,9.44 v1.43,9.19
  Bottom 0.152: v40.18,17.94 40.01,17.77 33.54,17.77 v33.56,17.78 | v15.48,17.44 9.68,17.44 9.18,17.94 9.18,18.69 8.93,18.94 4.43,18.94 3.68,18.19 v3.68,16.63 | v1.43,9.19 1.43,8.18 D3.A
N$6  (via drill 0.25)
  Top 0.254: J1.B5 7.78,9.94 8.18,10.34 9.39,10.34 9.86,9.87 9.86,7.67 10.72,6.82 v11.58,6.82 | v19.12,6.92 18.81,6.92 R1.1
  Bottom 0.254: v19.12,6.92 18.76,6.56 11.84,6.56 v11.58,6.82
N$11
  Top 0.254: U3.1 18.41,11.47 20.36,11.47 R3.2
N$12
  Top 0.254: U3.5 18.38,8.49 18.68,8.19 20.33,8.19 R4.1
N$14  (via drill 0.25)
  Top 0.152: R5.1 27.47,18.73 v27.43,18.69 | v22.23,20.4 22.02,20.19 19.56,20.19 19.38,20.37 16.48,20.37 15.94,19.83 15.94,18.7 15.62,18.38 9.5,18.38 8.93,17.8 7.32,17.8 6.93,18.19 3.43,18.19 v3.18,17.94
  Bottom 0.152: v27.43,18.69 27.16,18.96 23.36,18.96 23.02,19.31 23.02,20.11 22.68,20.44 22.27,20.44 v22.23,20.4 | v3.18,17.94 2.76,17.52 CON.C
NEOPIX  (via drill 0.25)
  Top 0.2: MDBT2.38 38.86,8.37 v38.93,8.44 | v4.18,4.94 4.18,5.38 4.18,5.39 4.18,8.41 4.12,8.47 4.12,12.39 v4.18,12.44
  Bottom 0.2: v38.93,8.44 38.93,2.94 38.43,2.44 5.18,2.44 4.93,2.69 4.93,4.19 v4.18,4.94 | v4.18,12.44 4.31,12.57 LED.1
NFC1  (via drill 0.25)
  Top 0.152: v45.16,10.82 45.26,10.82 MDBT2.52
  Bottom 0.152: NFC.TP 44.81,19.31 45.08,19.04 45.08,10.9 v45.16,10.82
QSPI_CS
  Top 0.152: MDBT2.44 41.66,6.49 41.43,6.25 41.43,4.19 42.03,3.6 IC2.1
QSPI_DATA0
  Top 0.152: MDBT2.41 40.06,5.11 IC2.5
QSPI_DATA1
  Top 0.152: MDBT2.46 42.46,6.1 42.58,5.99 43.41,5.99 43.61,5.78 43.61,4.61 43.23,4.23 42.58,4.23 IC2.2
QSPI_DATA2  (via drill 0.25)
  Top 0.152: MDBT2.45 42.06,8.31 v41.93,8.44 | v41.92,6.02 41.9,5.99 41.9,4.93 42.24,4.6 IC2.3
  Bottom 0.152: v41.93,8.44 41.92,8.43 v41.92,6.02
QSPI_DATA3
  Top 0.152: IC2.7 40.6,4.1 41.12,4.61 41.12,7.05 41.26,7.2 MDBT2.43
QSPI_SCK
  Top 0.152: MDBT2.42 40.81,7.33 40.81,5.07 40.34,4.6 IC2.6
RESET  (via drill 0.25)
  Top 0.152: v39.68,8.67 39.68,7.7 MDBT2.40 | MS1.1 6.35,3.61 7.41,4.67 7.41,6.77 v7.39,6.79 | v15.18,10.94 15.18,11.45 15.07,11.55 15.07,12.94 v14.9,13.11 | v33,16.92 32.93,16.99 32.93,17.69 32.62,18 29.69,18 29.55,18.14 v25.9,18.14
  Bottom 0.152: v39.68,8.67 39.86,8.85 40.65,8.85 41.09,9.29 41.09,13.66 41.93,14.5 RST.TP 41.75,15.87 33.25,15.87 33,16.12 v33,16.92 | v7.39,6.79 7.39,7.2 8.12,7.93 14.67,7.93 15.23,8.49 15.23,10.9 v15.18,10.94 | v14.9,13.11 14.9,16.48 15.32,16.9 18.01,16.9 RESET.B 19.42,17.12 19.86,16.68 20.51,16.68 20.95,17.12 RESET.B' 22.41,17.19 23.18,17.19 23.43,17.44 23.43,17.94 23.63,18.14 v25.9,18.14
RXD
  Top 0.152: MDBT2.48 43.7,6.78 43.94,6.54 43.94,3.08 43.62,2.77 39.76,2.77 39.37,2.38 MS1.14
SCK  (via drill 0.25)
  Top 0.152: MDBT2.36 38.06,8.28 v38.25,8.47 | v38.12,3.62 38.06,3.55 37.75,3.24 32.15,3.24 31.74,2.83 31.74,1.28 MS1.11
  Bottom 0.152: v38.12,3.62 v38.13,3.62 38.13,8.35 v38.25,8.47
SCL  (via drill 0.25)
  Top 0.152: MS1.18 41.18,20.86 41.18,18.44 40.84,18.1 v40.84,17.71 | v37.39,17.28 37.41,17.28 37.64,17.05 37.64,12.4 v37.45,12.21 | v37.68,10.58 37.33,10.23 MDBT2.27 | v10.22,6.45 10.22,4.78 v10.27,4.73
  Bottom 0.152: v10.27,4.73 30.72,4.73 31.43,5.44 31.43,19.69 31.56,19.82 40.86,19.82 41.18,19.5 41.18,18.44 40.84,18.1 v40.84,17.71 40.26,17.14 37.53,17.14 v37.39,17.28 | v37.45,12.21 37.46,12.21 37.54,12.13 37.54,10.72 v37.68,10.58 | U1.3 9.9,6.77 v10.22,6.45
SDA  (via drill 0.25)
  Top 0.152: MDBT2.29 36.79,9.46 36.82,9.46 | MS1.17 44.45,16.49 44.44,16.47 44.44,15.68 44.45,15.67 44.45,14.21 44.1,13.86 40.15,13.86 39.07,12.79 39.07,10.33 38.62,9.88 37.24,9.88 36.82,9.46 | v36.68,8.69 36.85,8.86 36.85,9.42 36.82,9.46
  Bottom 0.152: U1.4 34.97,4.23 35.18,4.44 35.18,8.44 35.43,8.69 v36.68,8.69
SWCLK  (via drill 0.25)
  Top 0.254: MDBT2.53 45.66,5.52 v45.6,5.45
  Bottom 0.152: 45.69,10.74 | 45.69,10.74 45.69,11.2 45.38,11.5 45.38,13.8 45.62,14.04 46.67,14.04 46.88,14.25 46.88,17.49 46.68,17.69 SWC.TP | v45.6,5.45 45.69,5.54 45.69,10.74
SWDIO  (via drill 0.25)
  Top 0.152: MDBT2.51 44.86,5.76 v44.93,5.69
  Bottom 0.152: SWD.TP 44.43,17.69 44.77,17.35 44.77,11.24 44.64,11.11 44.64,10.41 44.74,10.32 44.74,5.88 v44.93,5.69
SWO  (via drill 0.25)
  Top 0.152: v42.93,8.69 42.93,7.75 MDBT2.47
  Bottom 0.152: v42.93,8.69 43.11,8.87 43.51,8.87 43.68,9.04 43.68,12.86 42.99,13.55 42.99,16.13 42.68,16.44 42.68,16.94 SWO.TP
TXD
  Top 0.152: MDBT2.49 43.66,7.28 44.25,6.69 44.25,2.78 43.92,2.44 42.18,2.44 41.91,2.17 MS1.15
USBD+  (via drill 0.25)
  Top 0.152: MDBT2.35 37.66,5.42 37.43,5.19 36.68,5.19 v36.43,4.94 | R11.2 14.42,4.33 v14.42,2.95
  Bottom 0.152: v36.43,4.94 36.43,3.48 35.74,2.79 14.61,2.79 14.45,2.95 v14.42,2.95
USBD-  (via drill 0.25)
  Top 0.152: MDBT2.34 36.86,5.87 36.68,5.69 36.18,5.69 35.74,5.25 v35.74,4.94 | v15.93,3.38 15.93,4.09 R10.2
  Bottom 0.152: v35.74,4.94 35.74,3.64 35.52,3.42 16.71,3.42 16.73,3.4 15.95,3.4 v15.93,3.38
VBAT  (via drill 0.25)
  Top 0.254: C11.2 23.73,15.69 R12.4 23.79,17.03 26.23,17.03 26.72,16.54 26.72,12.73 v26.18,12.19 | Q3.3 v23.18,9.94 | v16.89,10.45 16.67,10.45 16.43,10.69 16.43,11.44 | 16.43,11.44 U3.3 | v11.09,13.84 12.05,14.8 X3.2 12.05,13.82 12.18,13.69 15.18,13.69 15.45,13.43 15.45,11.68 15.69,11.44 16.43,11.44
  Bottom 0.254: v16.89,10.45 23.13,10.45 23.18,10.4 v23.18,9.94 v23.17,9.95 23.17,11.85 23.52,12.2 v26.17,12.2 v26.18,12.19 | v11.09,13.84 11.09,15.44 S1.2
VBAT_SW  (via drill 0.25)
  Top 0.254: v8.68,18.31 8.68,18.45 8.98,18.74 15.36,18.74 15.58,18.96 15.58,20.66 MS1.28
  Bottom 0.254: S1.3 8.68,15.65 v8.68,18.31
VBUS  (via drill 0.25)
  Top 0.254: v20.18,17.19 20.28,17.09 R12.1 21.43,16.79 21.43,14.22 22.46,13.19 C8.2 24.13,12.29 Q3.1 | D1.A 27.67,10.92 24.15,10.92 Q3.1 | v7.22,8.23 7.43,8.44 7.43,9.16 7.25,9.34 6.05,9.34 J1.B4/A9 | v24.18,9.69 24.18,10.89 Q3.1 | MDBT2.32 32.48,7.43 31.16,6.11 24.41,6.11 24.18,6.34 v24.18,6.69 22.43,6.69 21.65,7.47 17.22,7.47 16.48,8.21 U3.4 15.7,8.11 11.27,8.11 11.1,8.28 v11.1,8.68 v11.11,8.69 | v7.18,13.94 6.16,13.94 J1.A4/B9
  Bottom 0.254: MS1.26 20.19,20.19 20.19,17.2 v20.18,17.19 | v7.22,8.23 6.85,7.87 3.4,7.87 CHG.A 3.16,13.19 3.66,13.69 5.22,13.69 5.47,13.94 v7.18,13.94 7.38,13.74 9.88,13.74 11.1,12.52 11.1,9.11 11.11,9.09 v11.11,8.69 | v24.18,6.69 v24.18,9.69
VDIV  (via drill 0.25)
  Top 0.152: MDBT2.10 40.86,17.01 40.63,17.25 39.43,17.25 39.18,17.5 39.18,18.15 v39.28,18.26 | R12.6 R12.5 23.73,19.49 23.82,19.58 32.68,19.58 32.88,19.39 32.88,19.04 v32.97,18.94
  Bottom 0.152: v39.28,18.26 39.26,18.23 34.13,18.23 33.92,18.45 33.92,18.46 33.43,18.94 v32.97,18.94
VHI  (via drill 0.25)
  Top 0.254: C9.2 28.62,7.26 D1.C 22.61,7.26 22.23,7.64 Q3.2 21.68,11.49 v21.68,13.19 | U2.1 19.17,19.53 21.93,19.53 22.03,19.43 R12.7 22.03,18.34 22.43,17.94 24.68,17.94 24.93,17.69 v24.93,17.6
  Bottom 0.254: v24.93,17.6 24.94,17.58 24.94,14.05 24.08,13.19 v21.68,13.19

### Text on the board
tNames: IC2 | IC2
_tplace: X3 | SDA | BAT | En | USB | 13 | 12 | 11 | 10 | 9 | 6 | 5 | J1 | SCL | SCOUTMAKES AZUL | A3 | A4 | A5 | SCK | MO | MI | D2 | RST | 3.3V | ARF | GND | A0 | A1 | A2 | RX | TX
_bplace: BAT | EN | USB | 13 | 12 | ScoutMakes / Azul | 11 | 10 | 9 | 6 | 5 | SCL | SDA | NFC | ON | RST | SWD | SWO | SWC | S1 | Make Something / Change Your World | RST | 3.3V | LED | G | GND | D3 | VCC | SCL | SDA | GND | A0 | A1 | A2 | A3 | A4 | A5 | SCK | MO | MI | RX | TX | D2 | RST | 3.3V | ARF